# Altium schematic sheet motor.SchDoc
size A4
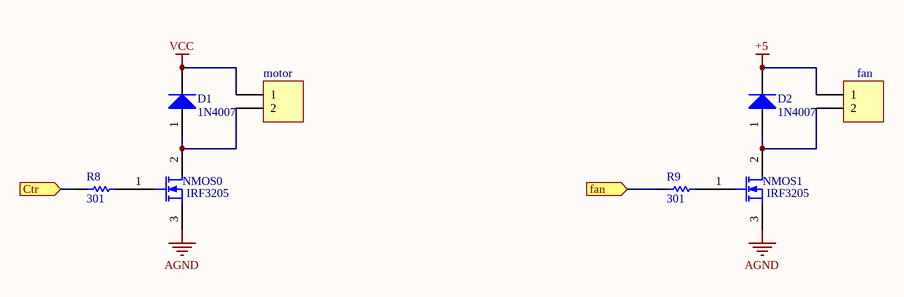
[diagram p0: motor.SchDoc]

## Parts
D1  1N4007  [SMA(M)]
D2  1N4007  [SMA(M)]
NMOS0  IRF3205  [TO-263-3(M)]
NMOS1  IRF3205  [TO-263-3(M)]
R8  value 301  [0805(M)]  (hidden comment: Res)
R9  value 301  [0805(M)]  (hidden comment: Res)
Ter0  motor  [KF301-2P(DIP)]
Ter1  fan  [KF301-2P(DIP)]

## Ports
Ctr (in), fan (in)

## Nets
+5: D2.2(N) Ter1.1
AGND: NMOS0.3(S) NMOS1.3(S)
VCC: D1.2(N) Ter0.1
Ctr: R8.1 ; port Ctr
fan: R9.1 ; port fan
NetD1_1: D1.1(P) NMOS0.2(D) Ter0.2
NetD2_1: D2.1(P) NMOS1.2(D) Ter1.2
NetNMOS0_1: NMOS0.1(G) R8.2
NetNMOS1_1: NMOS1.1(G) R9.2

## Library data of the parts
D1 D2 = Diode1: 整流二极管
NMOS0 NMOS1 = MOSFET-N
Ter0 Ter1 = KF301-2P: 接线端子 脚距5.08MM 300V/16A